# Altium schematic sheet Video.SCHDOC
size A4
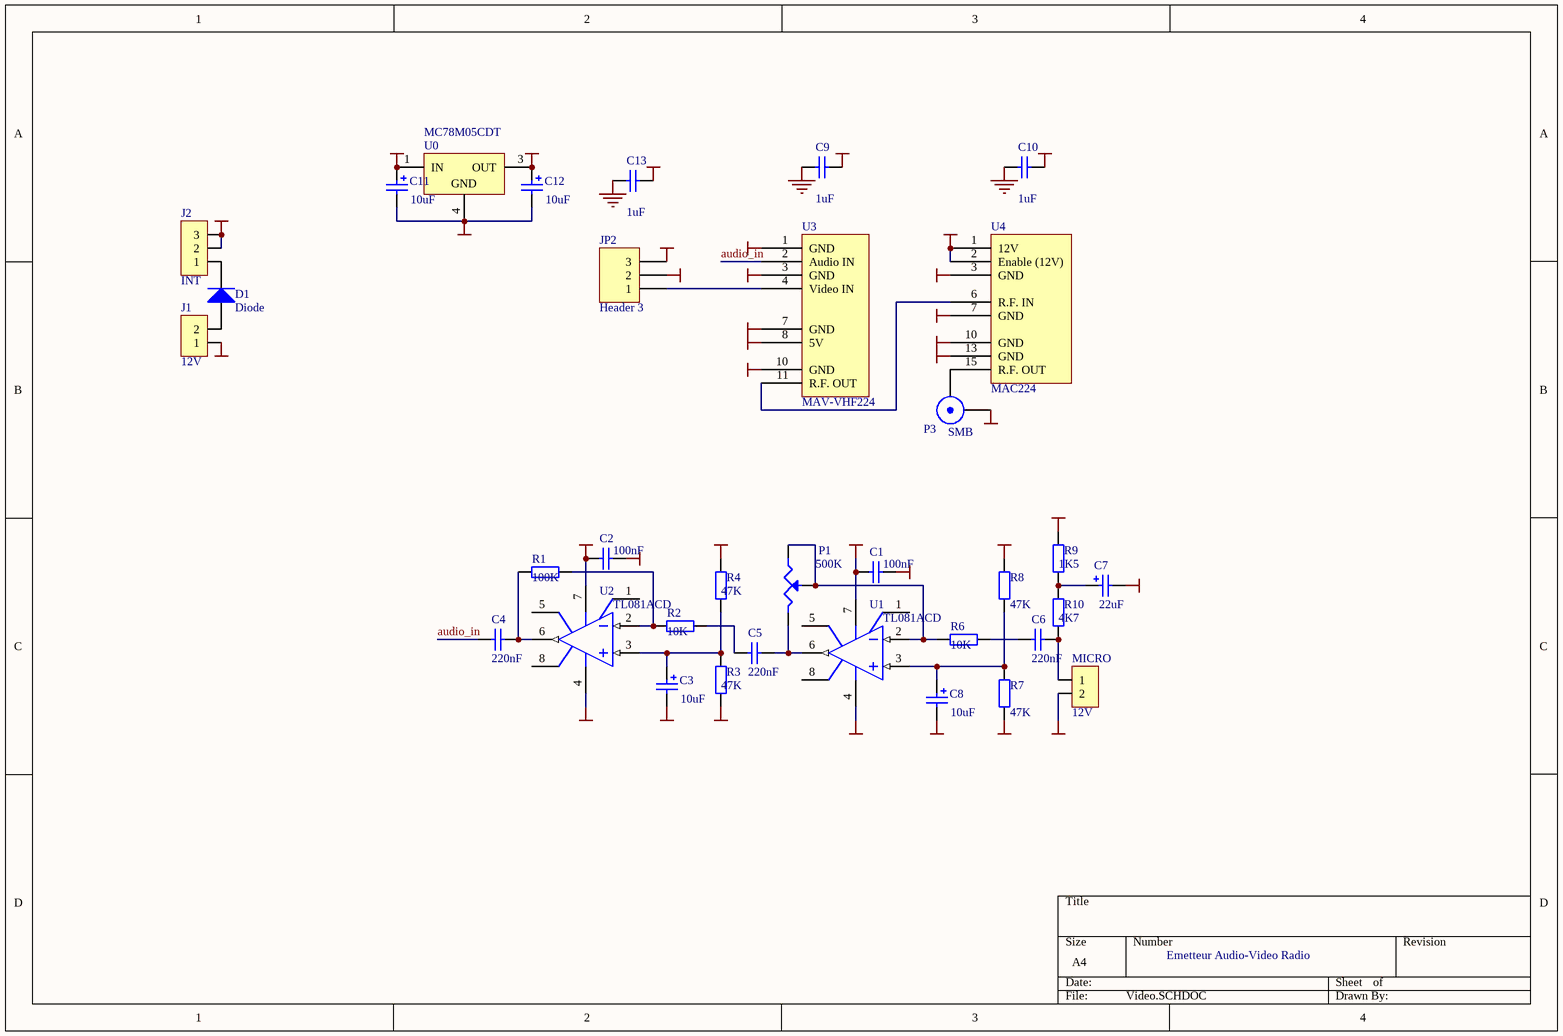
[diagram p0: Video.SCHDOC]

## Parts
C1  value 100nF  [0805]  (hidden comment: Cap)
C2  value 100nF  [1206]  (hidden comment: Cap)
C3  value 10uF  [1206]  (hidden comment: Cap Pol1)
C4  value 220nF  [0805]  (hidden comment: Cap)
C5  value 220nF  [0805]  (hidden comment: Cap)
C6  value 220nF  [0805]  (hidden comment: Cap)
C7  value 22uF  [1206]  (hidden comment: Cap Pol1)
C8  value 10uF  [1206]  (hidden comment: Cap Pol1)
C9  value 1uF  [1206]  (hidden comment: Cap)
C10  value 1uF  [1206]  (hidden comment: Cap)
C11  value 10uF  [1206]  (hidden comment: Cap Pol1)
C12  value 10uF  [1206]  (hidden comment: Cap Pol1)
C13  value 1uF  [1206]  (hidden comment: Cap)
D1  Diode  [DSO-C2/X3.3]
J1  12V  [CON2]
J2  INT  [TSIP3]
JP2  Header 3  [HDR1X3]
MICRO  12V  [CON2]
P1  value 500K  [VR4]  (hidden comment: TPOT)
P3  SMB  [SMB_V-RJ45]
R1  value 100K  [0805]  (hidden comment: Res2)
R2  value 10K  [0805]  (hidden comment: Res2)
R3  value 47K  [0805]  (hidden comment: Res2)
R4  value 47K  [0805]  (hidden comment: Res2)
R6  value 10K  [0805]  (hidden comment: Res2)
R7  value 47K  [0805]  (hidden comment: Res2)
R8  value 47K  [0805]  (hidden comment: Res2)
R9  value 1K5  [0805]  (hidden comment: Res2)
R10  value 4K7  [0805]  (hidden comment: Res2)
U0  MC78M05CDT  [369A-03]
U1  TL081ACD  [751-02]
U2  TL081ACD  [751-02]
U3  MAV-VHF224  [MAV-VHF224]
U4  MAC224  [MCA224]

## Nets
5V: C9.2 C12.1 C13.2 JP2.3 U0.3(OUT) U3.8(5V)
12V: C1.1 C2.1 C10.2 C11.1 J2.2 J2.3 R4.2 R8.2 R9.2 U0.1(IN) U1.7(V+) U2.7(V+) U4.1(12V) U4.2(Enable_(12V))
GND: C1.2 C2.2 C3.2 C7.2 C8.2 C9.1 C10.1 C11.2 C12.2 C13.1 J1.1 JP2.2 MICRO.2 P3.2(Y) R3.1 R7.2 U0.4(GND) U1.4(V-) U2.4(V-) U3.1(GND) U3.3(GND) U3.7(GND) U3.10(GND) U4.3(GND) U4.7(GND) U4.10(GND) U4.13(GND)
audio_in: C4.1 U3.2(Audio_IN)
NetC3_1: C3.1 R3.2 R4.1 U2.3(IN+)
NetC4_2: C4.2 R1.1 U2.6(OUT)
NetC5_1: C5.1 R2.2
NetC5_2: C5.2 P1.3 U1.6(OUT)
NetC6_1: C6.1 R6.2
NetC6_2: C6.2 MICRO.1 R10.1
NetC7_1: C7.1 R9.1 R10.2
NetC8_1: C8.1 R7.1 R8.1 U1.3(IN+)
NetD1_1: D1.1(A) J1.2
NetD1_2: D1.2(K) J2.1
NetJP2_1: JP2.1 U3.4(Video_IN)
NetP1_1: P1.1 P1.2 R6.1 U1.2(IN-)
NetP3_1: P3.1(X) U4.15(R.F._OUT)
NetR1_2: R1.2 R2.1 U2.2(IN-)
NetU3_11: U3.11(R.F._OUT) U4.6(R.F._IN)

Not connected (* = marked no-connect by the designer): U1 1(OS_NULL) 5(OS_NULL) 8(NC); U2 1(OS_NULL) 5(OS_NULL) 8(NC)

## Notes on the sheet
- Emetteur Audio-Video Radio

## Library data of the parts
C1 C2 C4-C6 C9 C10 C13 = Cap: Capacitor; Published: 8-Jun-2000; Revision: July-2002: Re-released for DXP Platform.; Publisher: Altium Limited
C3 C7 C8 C11 C12 = Cap Pol1: Polarized Capacitor (Radial); Published: 8-Jun-2000; Revision: July-2002: Re-released for DXP Platform.; Publisher: Altium Limited
D1 = Diode: Default Diode; Code - JEDEC: DO-214-AB; Published: 8-Jun-2000; Revision: July-2002: Re-released for DXP Platform.; Publisher: Altium Limited
J1 MICRO = CON2
J2 = TCON3
JP2 = Header 3: Header, 3-Pin; Revision: 17-Jul-2002: Re-released for DXP Platform.; Publisher: Altium Limited
P1 = TPOT: Potentiometre
P3 = SMB: SMB Straight Connector; Revision: 17-Jul-2002: Re-released for DXP Platform.; Publisher: Altium Limited
R1-R4 R6-R10 = Res2: Resistor; Published: 8-Jun-2000; Revision: July-2002: Re-released for DXP Platform.; Publisher: Altium Limited
U0 = MC78M05CDT: 3-Terminal Medium-Current Positive Fixed Voltage Regulator; Note: Heatsink suface connected to pin 4.; Published: 17-Jul-2002; DatasheetDocument: 1988; PackageReference: 369A-03; Publisher: Altium Limited
U1 U2 = TL081ACD: JFET-Input Operational Amplifier; Published: 17-Jul-2002; DatasheetDocument: 1988; PackageReference: 751-02; Publisher: Altium Limited; Code_JEDEC: MS-012-AA; Code_IPC: SO8